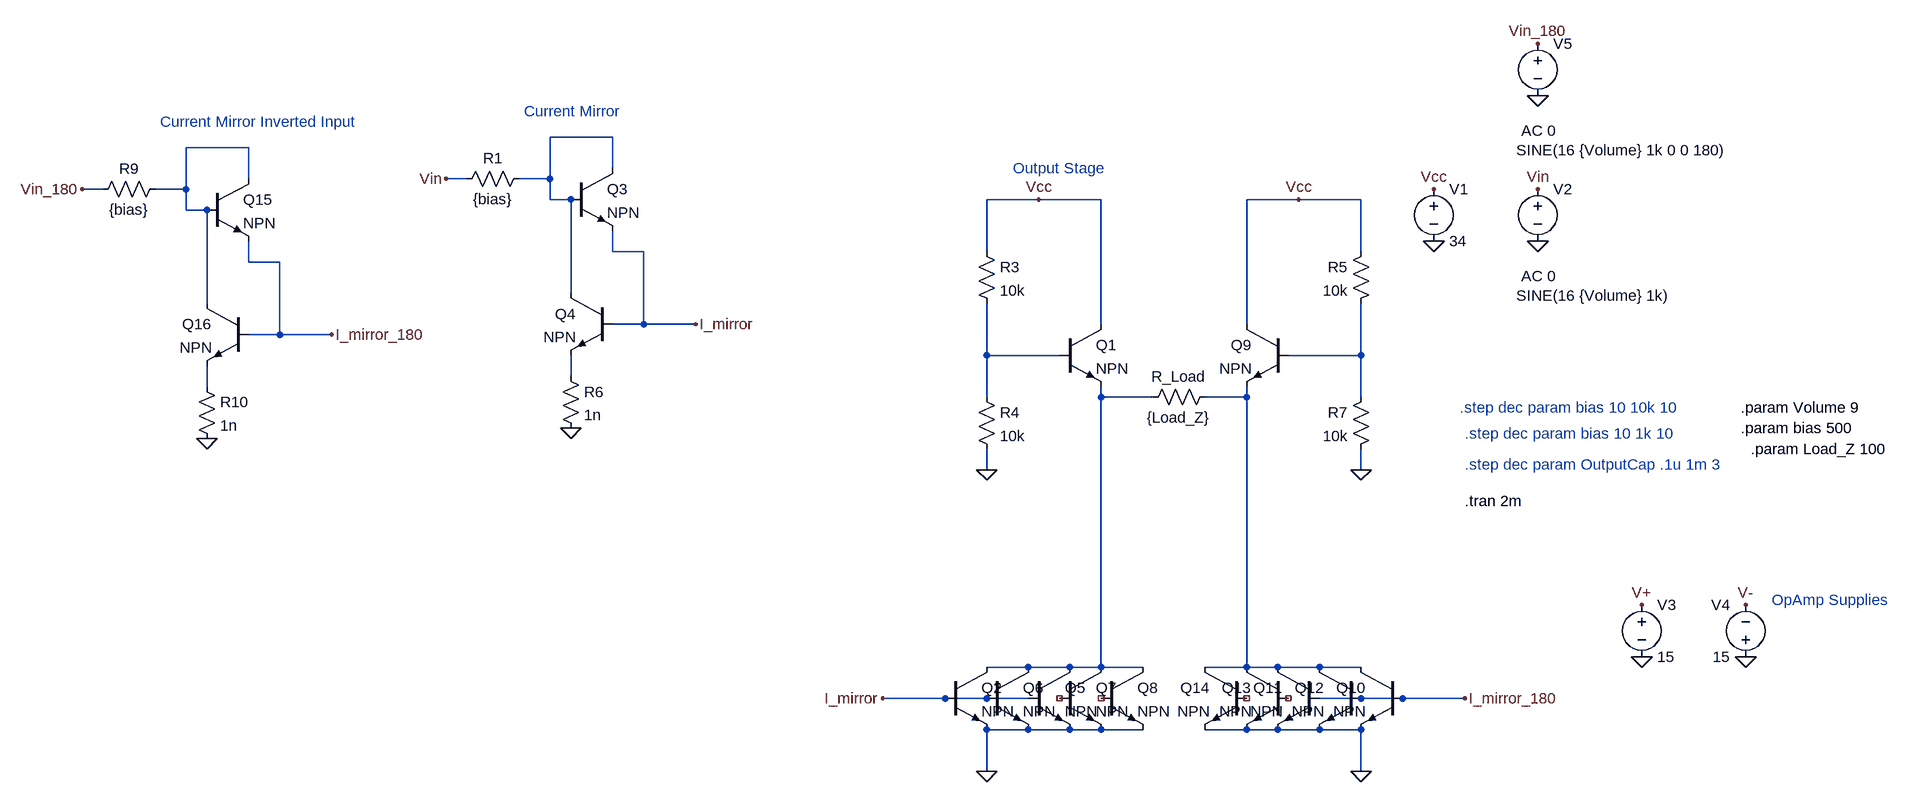
[diagram p0: schematic Dynamic_Bias_Bridged.asc]
Dynamic_Bias_Bridged.asc, the LTspice schematic file:
Version 4
SHEET 1 880 680
WIRE -1904 -528 -2000 -528
WIRE -2464 -512 -2560 -512
WIRE -1904 -480 -1904 -528
WIRE -2464 -464 -2464 -512
WIRE -2128 -464 -2160 -464
WIRE -2000 -464 -2000 -528
WIRE -2000 -464 -2048 -464
WIRE -2688 -448 -2720 -448
WIRE -2560 -448 -2560 -512
WIRE -2560 -448 -2608 -448
WIRE -2000 -432 -2000 -464
WIRE -1968 -432 -2000 -432
WIRE -1248 -432 -1328 -432
WIRE -1152 -432 -1248 -432
WIRE -848 -432 -928 -432
WIRE -752 -432 -848 -432
WIRE -2560 -416 -2560 -448
WIRE -2528 -416 -2560 -416
WIRE -1904 -352 -1904 -384
WIRE -1856 -352 -1904 -352
WIRE -1328 -352 -1328 -432
WIRE -752 -352 -752 -432
WIRE -2464 -336 -2464 -368
WIRE -2416 -336 -2464 -336
WIRE -1968 -288 -1968 -432
WIRE -2528 -272 -2528 -416
WIRE -1856 -240 -1856 -352
WIRE -1856 -240 -1904 -240
WIRE -1776 -240 -1856 -240
WIRE -1152 -240 -1152 -432
WIRE -928 -240 -928 -432
WIRE -2416 -224 -2416 -336
WIRE -2416 -224 -2464 -224
WIRE -2336 -224 -2416 -224
WIRE -1328 -192 -1328 -272
WIRE -1216 -192 -1328 -192
WIRE -752 -192 -752 -272
WIRE -752 -192 -864 -192
WIRE -1968 -160 -1968 -192
WIRE -2528 -144 -2528 -176
WIRE -1328 -128 -1328 -192
WIRE -1152 -128 -1152 -144
WIRE -1072 -128 -1152 -128
WIRE -928 -128 -928 -144
WIRE -928 -128 -992 -128
WIRE -752 -128 -752 -192
WIRE -1328 -16 -1328 -48
WIRE -752 -16 -752 -48
WIRE -1264 288 -1328 288
WIRE -1200 288 -1264 288
WIRE -1152 288 -1152 -128
WIRE -1152 288 -1200 288
WIRE -1088 288 -1152 288
WIRE -928 288 -928 -128
WIRE -928 288 -992 288
WIRE -880 288 -928 288
WIRE -816 288 -880 288
WIRE -752 288 -816 288
WIRE -1392 336 -1488 336
WIRE -1328 336 -1392 336
WIRE -1264 336 -1328 336
WIRE -752 336 -816 336
WIRE -688 336 -752 336
WIRE -592 336 -688 336
WIRE -1264 384 -1328 384
WIRE -1200 384 -1264 384
WIRE -1152 384 -1200 384
WIRE -1088 384 -1152 384
WIRE -928 384 -992 384
WIRE -880 384 -928 384
WIRE -816 384 -880 384
WIRE -752 384 -816 384
WIRE -1328 448 -1328 384
WIRE -752 448 -752 384
FLAG -640 -448 Vcc
FLAG -640 -368 0
FLAG -480 -368 0
FLAG -480 -448 Vin
FLAG -160 272 0
FLAG -320 272 0
FLAG -320 192 V+
FLAG -160 192 V-
FLAG -1248 -432 Vcc
FLAG -2160 -464 Vin
FLAG -1328 448 0
FLAG -1968 -80 0
FLAG -1776 -240 I_mirror
FLAG -1488 336 I_mirror
FLAG -1328 -16 0
FLAG -752 -16 0
FLAG -848 -432 Vcc
FLAG -752 448 0
FLAG -592 336 I_mirror_180
FLAG -2720 -448 Vin_180
FLAG -2528 -64 0
FLAG -2336 -224 I_mirror_180
FLAG -480 -592 0
FLAG -480 -672 Vin_180
SYMBOL voltage -640 -464 R0
WINDOW 123 0 0 Left 2
WINDOW 39 0 0 Left 2
SYMATTR InstName V1
SYMATTR Value 34
SYMBOL voltage -480 -464 R0
WINDOW 3 -33 180 Left 2
WINDOW 123 -25 150 Left 2
WINDOW 39 24 124 Left 2
SYMATTR Value SINE(16 {Volume} 1k)
SYMATTR Value2 AC 0
SYMATTR InstName V2
SYMBOL voltage -320 176 R0
WINDOW 123 0 0 Left 2
WINDOW 39 0 0 Left 2
SYMATTR InstName V3
SYMATTR Value 15
SYMBOL voltage -160 288 R180
WINDOW 0 24 96 Left 2
WINDOW 3 24 16 Left 2
WINDOW 123 0 0 Left 2
WINDOW 39 0 0 Left 2
SYMATTR InstName V4
SYMATTR Value 15
SYMBOL npn -1216 -240 R0
SYMATTR InstName Q1
SYMBOL npn -1392 288 R0
SYMATTR InstName Q2
SYMBOL npn -1968 -480 R0
SYMATTR InstName Q3
SYMBOL npn -1904 -288 M0
SYMATTR InstName Q4
SYMBOL res -2144 -448 R270
WINDOW 0 32 56 VTop 2
WINDOW 3 0 56 VBottom 2
SYMATTR InstName R1
SYMATTR Value {bias}
SYMBOL npn -1264 288 R0
SYMATTR InstName Q5
SYMBOL res -1344 -368 R0
SYMATTR InstName R3
SYMATTR Value 10k
SYMBOL res -1344 -144 R0
SYMATTR InstName R4
SYMATTR Value 10k
SYMBOL res -1984 -176 R0
SYMATTR InstName R6
SYMATTR Value 1n
SYMBOL res -1088 -112 R270
WINDOW 0 32 56 VTop 2
WINDOW 3 0 56 VBottom 2
SYMATTR InstName R_Load
SYMATTR Value {Load_Z}
SYMBOL npn -1328 288 R0
SYMATTR InstName Q6
SYMBOL npn -1216 288 R0
SYMATTR InstName Q7
SYMBOL npn -1152 288 R0
SYMATTR InstName Q8
SYMBOL npn -864 -240 M0
SYMATTR InstName Q9
SYMBOL res -736 -368 M0
SYMATTR InstName R5
SYMATTR Value 10k
SYMBOL res -736 -144 M0
SYMATTR InstName R7
SYMATTR Value 10k
SYMBOL npn -688 288 M0
SYMATTR InstName Q10
SYMBOL npn -816 288 M0
SYMATTR InstName Q11
SYMBOL npn -752 288 M0
SYMATTR InstName Q12
SYMBOL npn -864 288 M0
SYMATTR InstName Q13
SYMBOL npn -928 288 M0
SYMATTR InstName Q14
SYMBOL npn -2528 -464 R0
SYMATTR InstName Q15
SYMBOL npn -2464 -272 M0
SYMATTR InstName Q16
SYMBOL res -2704 -432 R270
WINDOW 0 32 56 VTop 2
WINDOW 3 0 56 VBottom 2
SYMATTR InstName R9
SYMATTR Value {bias}
SYMBOL res -2544 -160 R0
SYMATTR InstName R10
SYMATTR Value 1n
SYMBOL voltage -480 -688 R0
WINDOW 3 -33 180 Left 2
WINDOW 123 -25 150 Left 2
WINDOW 39 24 124 Left 2
SYMATTR Value SINE(16 {Volume} 1k 0 0 180)
SYMATTR Value2 AC 0
SYMATTR InstName V5
TEXT -592 32 Left 2 !.tran 2m
TEXT -600 -112 Left 2 ;.step dec param bias 10 10k 10
TEXT -592 -72 Left 2 ;.step dec param bias 10 1k 10
TEXT -592 -24 Left 2 ;.step dec param OutputCap .1u 1m 3
TEXT -120 184 Left 2 ;OpAmp Supplies
TEXT -1288 -480 Left 2 ;Output Stage
TEXT -2040 -568 Left 2 ;Current Mirror
TEXT -168 -112 Left 2 !.param Volume 9
TEXT -2600 -552 Left 2 ;Current Mirror Inverted Input
TEXT -168 -80 Left 2 !.param bias 500
TEXT -152 -48 Left 2 !.param Load_Z 100

The netlist it stands for:
* Dynamic_Bias_Bridged.asc
V1 Vcc 0 34
V2 Vin 0 SINE(16 {Volume} 1k) AC 0
V3 V+ 0 15
V4 0 V- 15
Q1 Vcc N003 N007 0 NPN
Q2 N007 I_mirror 0 0 NPN
Q3 N001 N001 I_mirror 0 NPN
Q4 N001 I_mirror N005 0 NPN
R1 Vin N001 {bias}
Q5 N007 I_mirror 0 0 NPN
R3 Vcc N003 10k
R4 N003 0 10k
R6 N005 0 1n
R_Load N007 N008 {Load_Z}
Q6 N007 I_mirror 0 0 NPN
Q7 N007 NC_01 0 0 NPN
Q8 N007 NC_02 0 0 NPN
Q9 Vcc N004 N008 0 NPN
R5 Vcc N004 10k
R7 N004 0 10k
Q10 N008 I_mirror_180 0 0 NPN
Q11 N008 I_mirror_180 0 0 NPN
Q12 N008 I_mirror_180 0 0 NPN
Q13 N008 NC_03 0 0 NPN
Q14 N008 NC_04 0 0 NPN
Q15 N002 N002 I_mirror_180 0 NPN
Q16 N002 I_mirror_180 N006 0 NPN
R9 Vin_180 N002 {bias}
R10 N006 0 1n
V5 Vin_180 0 SINE(16 {Volume} 1k 0 0 180) AC 0
.model NPN NPN
.model PNP PNP
.lib standard.bjt
.tran 2m
* .step dec param bias 10 10k 10
* .step dec param bias 10 1k 10
* .step dec param OutputCap .1u 1m 3
* OpAmp Supplies
* Output Stage
* Current Mirror
.param Volume 9
* Current Mirror Inverted Input
.param bias 500
.param Load_Z 100
.backanno
.end